# Altium schematic sheet HSensor.schdoc
size A4 portrait; Symbol: Sheet-Symbol_A4; Device: Sheet-Symbol_A4; @Project Name: HumiditySensor; @Page Count: 1; @Update Date: 2025-10-28; @Create Date: 2025-10-28; @Schematic Name: Hsensor; @Page No: 1; @Page Name: P1_1; Version: V0.1; Page Size: A4; @Create Time: 08:18:40; @Update Time: 11:18:41; Title Block Position: 3; Width: 1170; Height: 825; Region Start: 1; X Region Count: 6; Y Region Count: 4; Blade Width: 10; @Board Name: HSensorV1
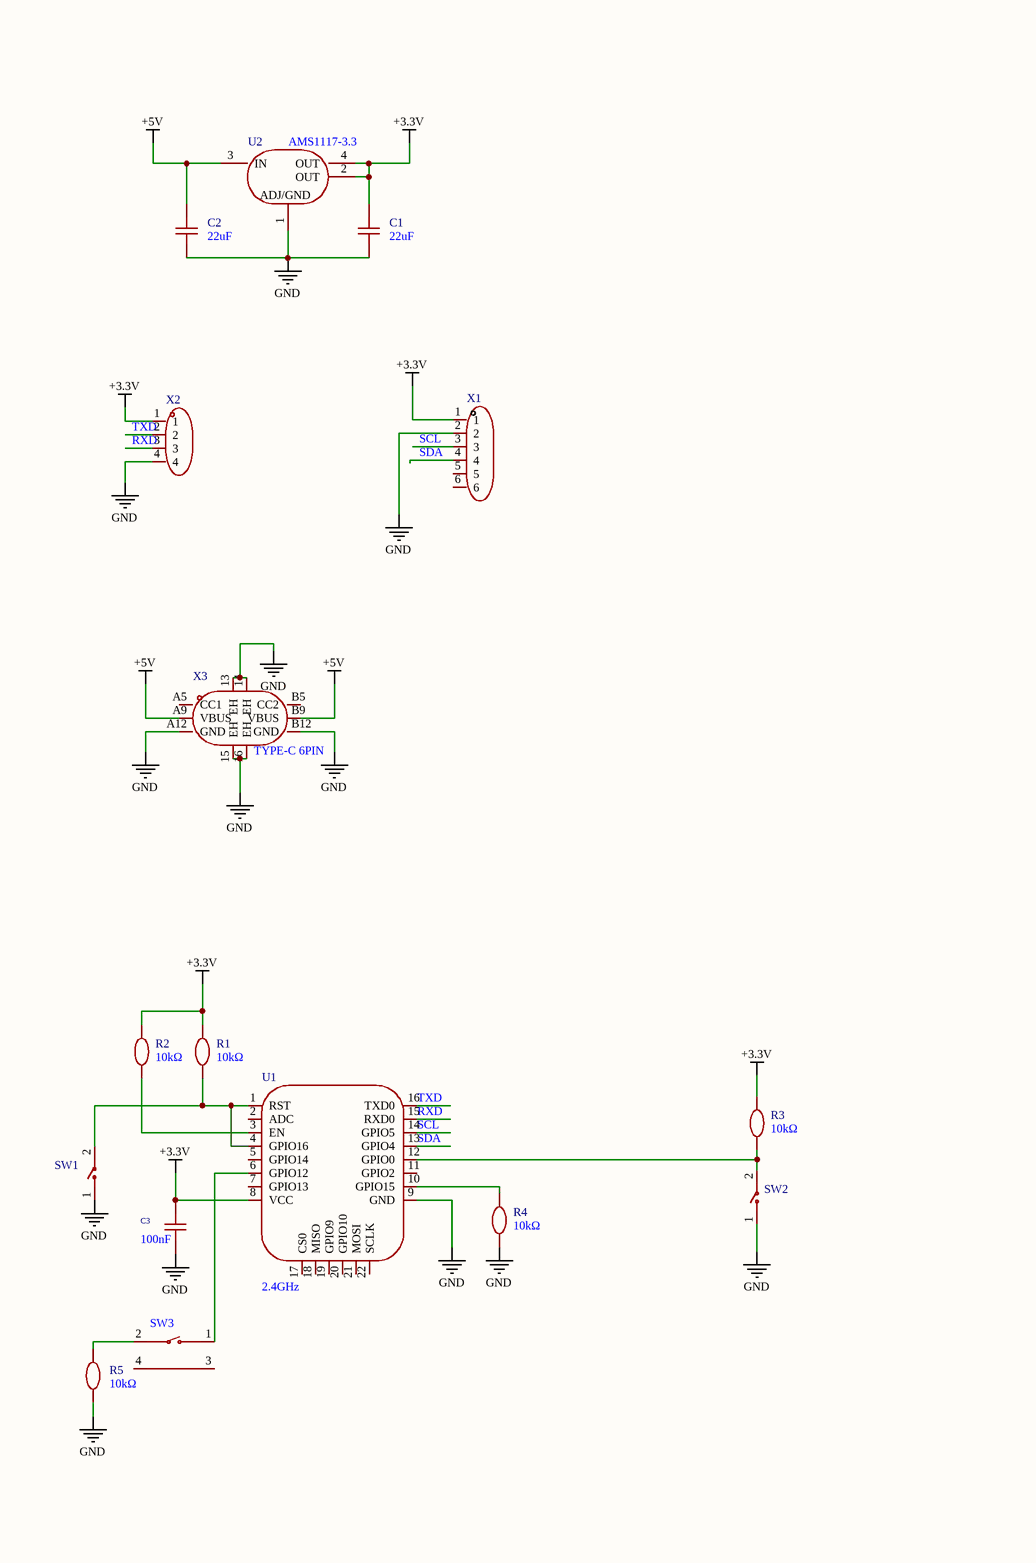
[diagram p0: HSensor.schdoc]

## Parts
C1  22uF  [C1206]
C2  22uF  [C1206]
C3  100nF  [C0603]
R1  10kΩ  [R0805]
R2  10kΩ  [R0805]
R3  10kΩ  [R0805]
R4  10kΩ  [R0805]
R5  10kΩ  [R0805]
SW1  TS-3025-A-C-A  [SW-SMD_L3.0-W2.5-P3.40-LS4.0-EH]  (value not drawn)
SW2  TS-3025-A-C-A  [SW-SMD_L3.0-W2.5-P3.40-LS4.0-EH]  (value not drawn)
SW3  KAN3543-0351C1-29/449  [SW-SMD_GANGYUAN_KAN3543-0351C1]  (value not drawn)
U1  2.4GHz  [WIFIM-SMD_ESP-12F-ESP8266MOD]
U2  AMS1117-3.3  [SOT-223-3_L6.4-W3.5-P2.30-LS7.0-BR]
X1  PZ2.54-1*6-FWZ  [HDR-TH_6P-P2.54-H-M-W8.6-N]  (value not drawn)
X2  PZ2.54-1x4-11.2  [HDR-TH_4P-P2.54-V-M]  (value not drawn)
X3  TYPE-C 6PIN  [USB-C-SMD_HX-TYPE-C-6PIN]

## Nets
+3.3V: C1.2 C3.2 R1.2 R2.2 R3.2 U1.8(VCC) U2.2(OUT) U2.4(OUT) X1.1 X2.1
+5V: C2.2 U2.3(IN) X3.A9(VBUS) X3.B9(VBUS)
GND: C1.1 C2.1 C3.1 R4.1 R5.1 SW1.1 SW2.1 U1.9(GND) U2.1(ADJ/GND) X1.2 X2.4 X3.13(EH) X3.14(EH) X3.15(EH) X3.16(EH) X3.A12(GND) X3.B12(GND)
RXD: U1.15(RXD0) X2.3
SCL: U1.14(GPIO5) X1.3
SDA: U1.13(GPIO4) X1.4
TXD: U1.16(TXD0) X2.2
NetR1_1: R1.1 SW1.2 U1.1(RST) U1.4(GPIO16)
NetR2_1: R2.1 U1.3(EN)
NetR3_1: R3.1 SW2.2 U1.12(GPIO0)
NetR4_2: R4.2 U1.10(GPIO15)
NetR5_2: R5.2 SW3.2
NetSW3_1: SW3.1 U1.6(GPIO12)

Not connected (* = marked no-connect by the designer): SW3 3 4; U1 2(ADC) 5(GPIO14) 7(GPIO13) 11(GPIO2) 17(CS0) 18(MISO) 19(GPIO9) 20(GPIO10) 21(MOSI) 22(SCLK); X1 5 6; X3 A5(CC1) B5(CC2)

## Notes on the sheet
- Перв.примен.
- Справ.№
- Подп. и дата
- Инв.№ дубл.
- Взам.инв.№
- Подп.и дата
- Разраб.
- Изм.
- Лист
- № докум.
- Подп.
- Дата
- Лит.
- Масштаб
- Масса
- Т.контр.
- Пров.
- Схема электрическая
- принципиальная
- Листов
- Инв.№ подл.
- Утв.
- Н.контр.
- Нач.сект.
- Копировал
- Формат А4

## Library data of the parts
C1 C2 = CL31A226KOHNNNE: Manufacturer: SAMSUNG(三星); Add into BOM: yes; Tolerance: ±10%; Symbol: CL31A226KOHNNNE; Device: CL31A226KOHNNNE; LCSC Part Name: 22uF ±10% 16V; Supplier Part: C90146; Manufacturer Part: CL31A226KOHNNNE; Supplier Footprint: 1206; JLCPCB Part Class: Extended Part; Datasheet: https://atta.szlcsc.com/upload/public/pdf/source/20161228/1482890861309.pdf; Supplier: LCSC; Convert to PCB: yes; Value: 22uF
C3 = CC0603KRX7R9BB104: Manufacturer: YAGEO(国巨); Add into BOM: yes; Tolerance: ±10%; Symbol: CC0603KRX7R9BB104; Device: CC0603KRX7R9BB104; Supplier: LCSC; Manufacturer Part: CC0603KRX7R9BB104; Value: 100nF; Supplier Part: C14663; JLCPCB Part Class: Basic Part; LCSC Part Name: 100nF ±10% 50V; Supplier Footprint: 0603; Datasheet: https://atta.szlcsc.com/upload/public/pdf/source/20180910/C282072_33301C7F631E79921B82A8DAC6BCC5B3.pdf; Convert to PCB: yes
R1-R5 = FRC0805J103TS: Manufacturer: FOJAN(富捷); Add into BOM: yes; Tolerance: ±5%; Temperature Coefficient: ±100ppm/℃; Symbol: FRC0805J103TS; Device: FRC0805J103TS; LCSC Part Name: 10kΩ ±5% 125mW 厚膜电阻; Supplier Part: C2930231; Manufacturer Part: FRC0805J103TS; Supplier Footprint: 0805; JLCPCB Part Class: Extended Part; Datasheet: https://atta.szlcsc.com/upload/public/pdf/source/20211221/925EC7D7225764EE0046F22065062C87.pdf; Supplier: LCSC; Convert to PCB: yes; Type: Thick Film Resistors; Value: 10kΩ; Operating Temperature Range: -55℃~+155℃
SW1 SW2 = TS-3025-A-C-A: Manufacturer: XKB Connection(中国星坤); Add into BOM: yes; Symbol: TS-3025-A-C-A; Device: TS-3025-A-C-A; LCSC Part Name: TS-3025-A-C-A; Supplier Part: C21262543; Manufacturer Part: TS-3025-A-C-A; Supplier Footprint: SMD,3x2.5mm; JLCPCB Part Class: Extended Part; Datasheet: https://atta.szlcsc.com/upload/public/pdf/source/20240311/2F9F0ACEA478707B65F44F482F46801A.pdf; Supplier: LCSC; Convert to PCB: yes
SW3 = KAN3543-0351C1-29/449: Manufacturer: GANGYUAN(港源); Add into BOM: yes; Circuit: SPST; Actuator Style: Rectangular Button; Operating Force: 2.6N; Switch Height: 3.5mm; Contact Current: 50mA; Voltage Rating: 12V; Actuator/Cap Color: Black; Life: 30,000 Cycles; Symbol: KAN3543-0351C1-29/449; Device: KAN3543-0351C1-29/449; LCSC Part Name: KAN3543-0351C1-29/449; Supplier Part: C2831427; Manufacturer Part: KAN3543-0351C1-29/449; Supplier Footprint: SMD; JLCPCB Part Class: Extended Part; Datasheet: https://item.szlcsc.com/datasheet/KAN3543-0351C1-29%252F449/2985250.html; Supplier: LCSC; Convert to PCB: yes; Mounting Type: Surface Mount, Right Angle; Termination Style: SMD(SMT) Tab; Operating Temperature: -20℃~+70℃
U1 = ESP-12F(ESP8266MOD): Manufacturer: Ai-Thinker(安信可); Add into BOM: yes; Core Processor: ESP8266 chip; Support Interface: GPIO；UART；I2C；PWM；SPI；ADC; Antenna Type: On-board PCB antenna; Output Power: 16dBm; Operating Voltage: 3.3V; Receive  Current: 120mA; Send  Current: 170mA; Sensitivity: -90dBm; Symbol: ESP-12F(ESP8266MOD); Device: ESP-12F(ESP8266MOD); LCSC Part Name: 完整的802.11b/g/nWi-FiSoC模块 屏蔽罩上的丝印是：ESP8266MOD，ESP8266EX串口WIFI; Supplier Part: C82891; Manufacturer Part: ESP-12F(ESP8266MOD); Supplier Footprint: SMD,16x24mm; JLCPCB Part Class: Extended Part; Datasheet: https://atta.szlcsc.com/upload/public/pdf/source/20210219/C82891_ABD84A460F4F056A2757267CCCA4B508.pdf; Supplier: LCSC; Convert to PCB: yes; Wireless Standard: -; Value: 2.4GHz; Operating Temperature: -40℃~+85℃
U2 = AMS1117-3.3: Manufacturer: 国芯佳品; Symbol: AMS1117-3.3_C2992570; Add into BOM: yes; Output Type: Fixed; Voltage - Supply: 15V; Output Voltage: 3.3V; Output Current: 1A; Output Configuration: Positive electrode; Number of Outputs: 1; Device: AMS1117-3.3; LCSC Part Name: AMS1117-3.3; Supplier Part: C2992570; Manufacturer Part: AMS1117-3.3; Supplier Footprint: SOT-223-3; JLCPCB Part Class: Extended Part; Datasheet: https://atta.szlcsc.com/upload/public/pdf/source/20220729/0D21C21EC310E4778671BF6BAE438640.pdf; Supplier: LCSC; Convert to PCB: yes; Power Supply Rejection Ratio (PSRR): -; Features: Overcurrent Protection(OCP); Operating Temperature: -40℃~+125℃
X1 = PZ2.54-1*6-FWZ: Manufacturer: ZHOURI(洲日); Add into BOM: yes; Pin Structure: 1x6P; Pitch: 2.54mm; Symbol: PZ2.54-1*6-FWZ; Device: PZ2.54-1*6-FWZ; LCSC Part Name: 1x6P 间距:2.54mm 弯插; Supplier Part: C5224019; Manufacturer Part: PZ2.54-1*6-FWZ; Supplier Footprint: 弯插,P=2.54mm; JLCPCB Part Class: Extended Part; Datasheet: https://atta.szlcsc.com/upload/public/pdf/source/20221031/449CCE7DD9C4566C07767508B7CDF883.pdf; Supplier: LCSC; Convert to PCB: yes; Mounting Type: Right-Angle; Number of Rows: Single Row; Number of Pins: 6P; Contact Plating: Gold
X2 = PZ2.54-1x4-11.2: Manufacturer: ZHOURI(洲日); Add into BOM: yes; Symbol: PZ2.54-1X4-11.2; Device: PZ2.54-1x4-11.2; LCSC Part Name: 排针 1*4 2.54 11.2MM; Supplier Part: C29779969; Manufacturer Part: PZ2.54-1x4-11.2; Supplier Footprint: 插件,P=2.54mm; JLCPCB Part Class: Extended Part; Datasheet: https://atta.szlcsc.com/upload/public/pdf/source/20240716/87ED6DC748AB2DDC8D0FB56ADB02351F.pdf; Supplier: LCSC; Convert to PCB: yes
X3 = HX TYPE-C 6PIN: Manufacturer: hanxia(韩下); Add into BOM: yes; Gender: Female; Number of Contacts: 6P; Number of Ports: 1; Current Rating - Power (Max): 3A; Rated Voltage (Max): 20V; Connect-Disconnect Life: 5000 Cuts; Center Height: 1.68mm; Core Colour: Black; Symbol: HX TYPE-C 6PIN; Device: HX TYPE-C 6PIN; Convert to PCB: yes; Manufacturer Part: TYPE-C 6PIN; Supplier: LCSC; Supplier Part: C18357552; LCSC Part Name: Type-C 母 卧贴; Supplier Footprint: SMD; JLCPCB Part Class: Extended Part; Datasheet: https://atta.szlcsc.com/upload/public/pdf/source/20231016/2369FEA7AA78F6601D2C568225A956AD.pdf; Connector Type: Type-C; Mounting Style: Horizontal attachment; Length: 6.8mm; Operating Temperature Range: -30℃~+80℃